# EAGLE design communication (EAGLE 6.1)
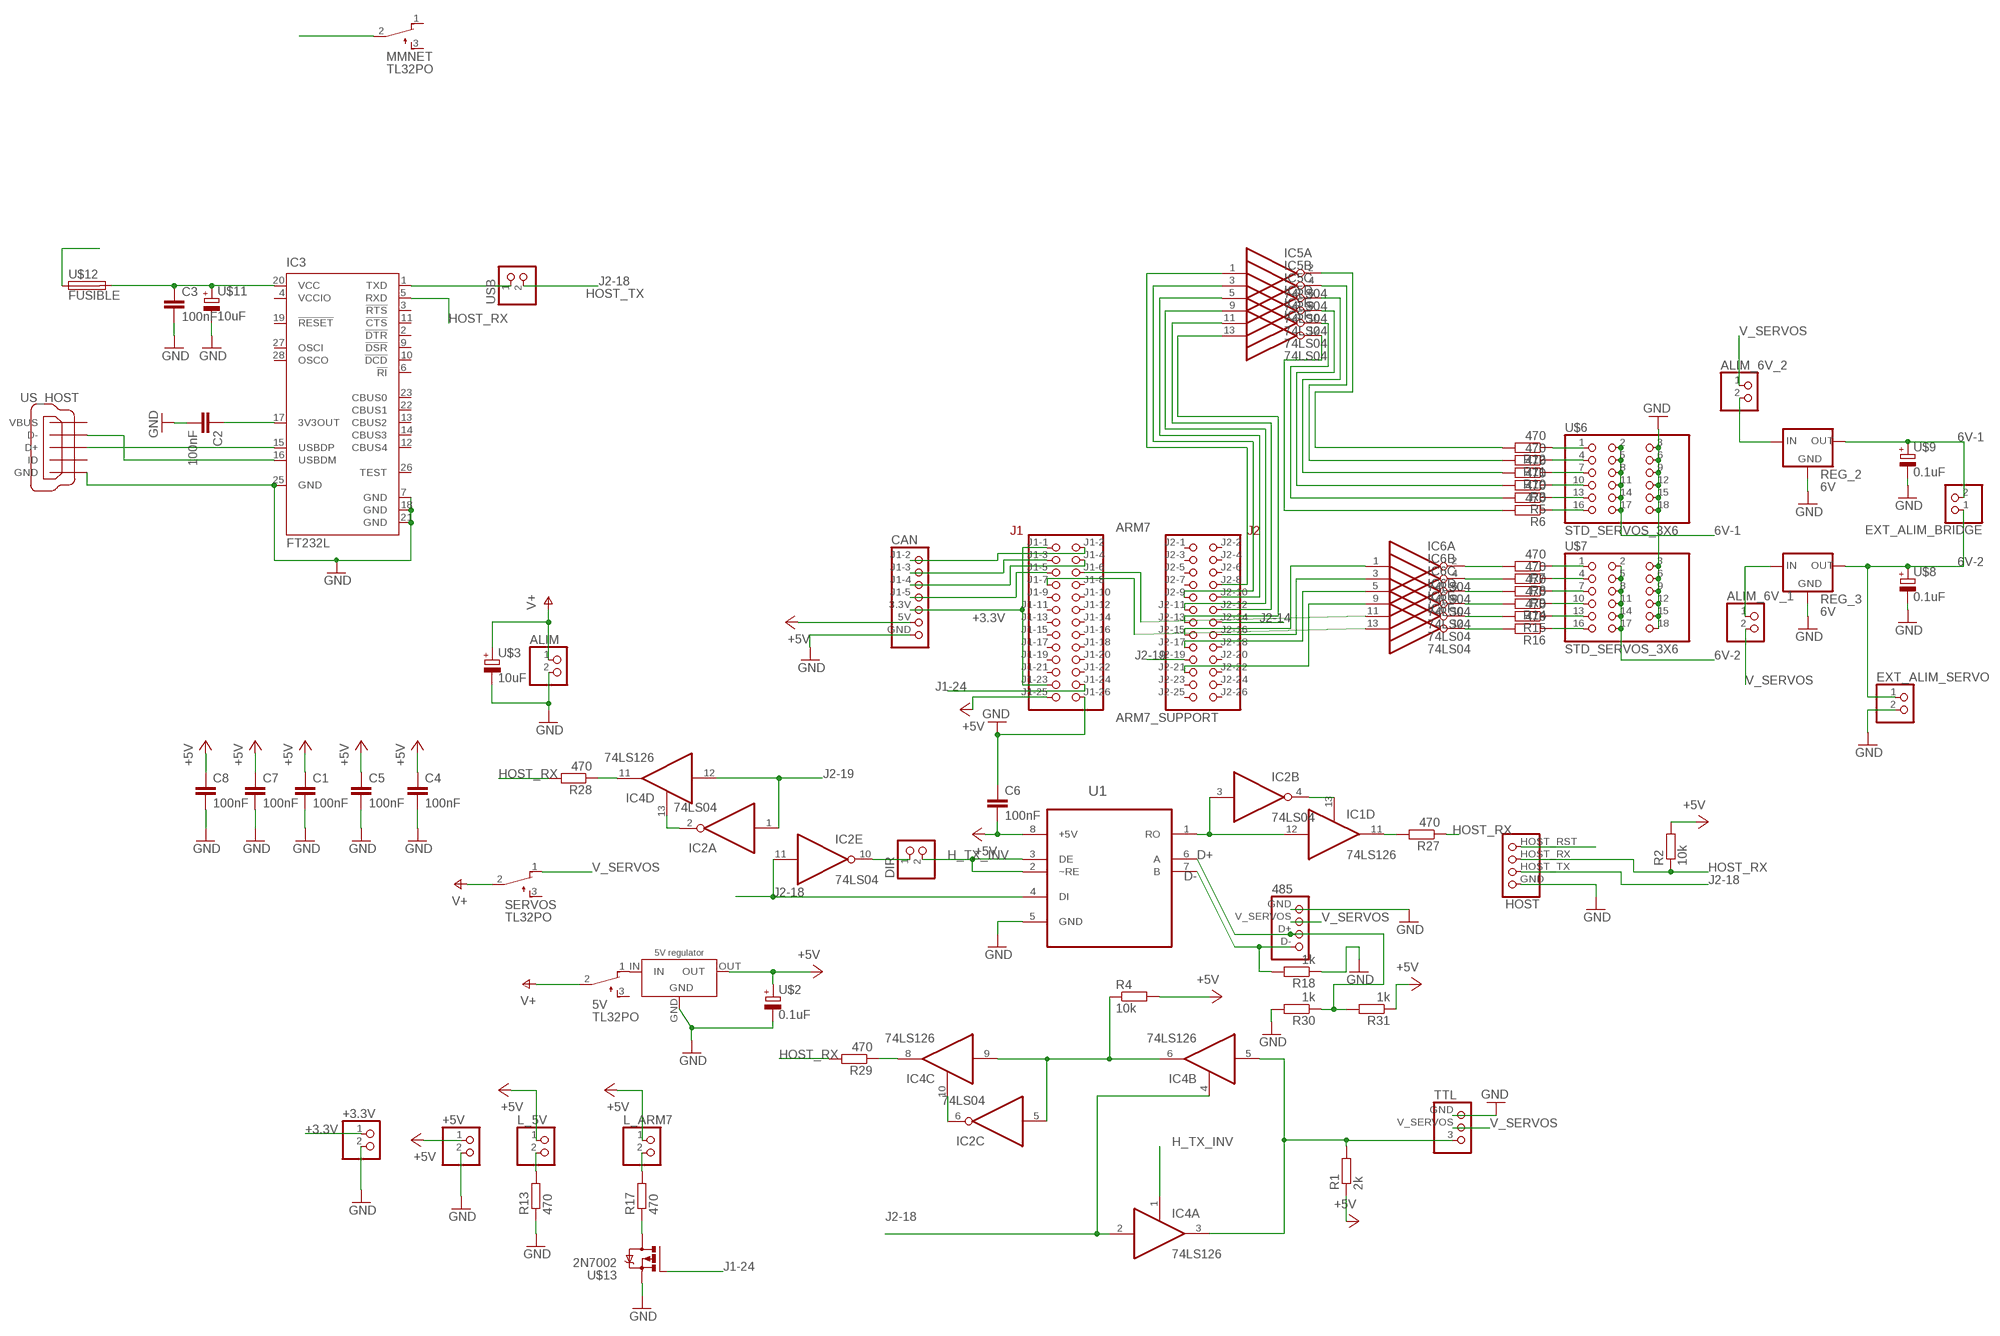
[diagram p0: schematic, sheet 1]

## Parts
5V  TL32PO  [TL3XPO]
485  CONNECTEUR_485  [CONNECTEUR_485]
+3.3V  CONNEC_1X02  [CONNEC_1X02]
+5V  CONNEC_1X02  [CONNEC_1X02]
ALIM  CONNEC_1X02CONNEC_1X02_LARGE  [CONNEC_ALIM]
ALIM_6V_1  CONNEC_1X02  [CONNEC_1X02]
ALIM_6V_2  CONNEC_1X02  [CONNEC_1X02]
ARM7  ARM7_SUPPORT  [ARM7_SUPPORT]
C1  100nF  C_EU_0805  [R0805]
C2  100nF  C_EU_0805  [R0805]
C3  100nF  C_EU_0805  [R0805]
C4  100nF  C_EU_0805  [R0805]
C5  100nF  C_EU_0805  [R0805]
C6  100nF  C_EU_0805  [R0805]
C7  100nF  C_EU_0805  [R0805]
C8  100nF  C_EU_0805  [R0805]
CAN  CONNECTEUR_CAN  [CONNECTEUR_CAN]
DIR  CONNEC_1X02  [CONNEC_1X02]
EXT_ALIM_BRIDGE  CONNEC_1X02  [CONNEC_1X02]
EXT_ALIM_SERVO  CONNEC_1X02CONNEC_1X02_LARGE  [CONNEC_ALIM]
HOST  CONNECTOR_HOST  [CONNECTOR_HOST]
IC1  74LS126  74LS126D  [SO14]
IC2  74LS04  74LS04D  [SO14]
IC3  FT232L  [SSOP28]
IC4  74LS126  74LS126D  [SO14]
IC5  74LS04  74LS04D  [SO14]
IC6  74LS04  74LS04D  [SO14]
L_5V  CONNEC_1X02  [CONNEC_1X02]
L_ARM7  CONNEC_1X02  [CONNEC_1X02]
MMNET  TL32PO  [TL3XPO]
R1  2k  R-EU_R0805  [R0805@1]
R2  10k  R-EU_R0805  [R0805@1]
R3  470  R-EU_R0805  [R0805@1]
R4  10k  R-EU_R0805  [R0805@1]
R5  470  R-EU_R0805  [R0805@1]
R6  470  R-EU_R0805  [R0805@1]
R7  470  R-EU_R0805  [R0805@1]
R8  470  R-EU_R0805  [R0805@1]
R9  470  R-EU_R0805  [R0805@1]
R10  470  R-EU_R0805  [R0805@1]
R11  470  R-EU_R0805  [R0805@1]
R12  470  R-EU_R0805  [R0805@1]
R13  470  R-EU_R0805  [R0805@1]
R14  470  R-EU_R0805  [R0805@1]
R15  470  R-EU_R0805  [R0805@1]
R16  470  R-EU_R0805  [R0805@1]
R17  470  R-EU_R0805  [R0805@1]
R18  1k  R-EU_R0805  [R0805@1]
R27  470  R-EU_R0805  [R0805@1]
R28  470  R-EU_R0805  [R0805@1]
R29  470  R-EU_R0805  [R0805@1]
R30  1k  R-EU_R0805  [R0805@1]
R31  1k  R-EU_R0805  [R0805@1]
REG_2  6V  78XXL  [78XXL]
REG_3  6V  78XXL  [78XXL]
SERVOS  TL32PO  [TL3XPO]
TTL  CONNECTEUR_TTL  [CONNECTEUR_TTL]
U1  MAX485EESA+  [SOIC127P600X175-8N]
U$2  0.1uF  CPOL_EUCPOL_EU_2.54-6  [E2,5-6]
U$3  10uF  CPOL_EUCPOL_EU_5-10,5  [E5-10,5]
U$6  STD_SERVOS_3X6  [STD_SERVOS_3X6]
U$7  STD_SERVOS_3X6  [STD_SERVOS_3X6]
U$8  0.1uF  CPOL_EUCPOL_EU_2.54-6  [E2,5-6]
U$9  0.1uF  CPOL_EUCPOL_EU_2.54-6  [E2,5-6]
U$11  10uF  CPOL_EUCPOL_EU_5-10,5  [E5-10,5]
U$12  FUSIBLE  [FUSIBLE]
U$13  2N7002  [SOT-23]
U$14  5V regulator  REGULATEUR_CMS  [REGULATEUR_CMS]
US_HOST  MINIUSB  [MINI_USB]
USB  CONNEC_1X02  [CONNEC_1X02]

## Nets
6V-1: EXT_ALIM_BRIDGE.2 REG_2.OUT U$6.2 U$6.5 U$6.8 U$6.11 U$6.14 U$6.17 U$9.+
6V-2: EXT_ALIM_BRIDGE.1 EXT_ALIM_SERVO.1 REG_3.OUT U$7.2 U$7.5 U$7.8 U$7.11 U$7.14 U$7.17 U$8.+
+3.3V: +3.3V.1 ARM7.J1-1 ARM7.J1-23 CAN.3.3V
+5V: +5V.1 ARM7.J1-25 C1.1 C3.1 C4.1 C5.1 C6.2 C7.1 C8.1 CAN.5V IC3.20(VCC) L_5V.1 L_ARM7.1 R1.1 R2.2 R4.2 R31.1 U1.8(+5V) U$2.+ U$11.+ U$12.P$1 U$12.P$2 U$14.OUT
B$1: ARM7.J2-8 IC5.1(A:I)
B$2: ARM7.J2-9 IC5.3(B:I)
B$3: ARM7.J2-10 IC5.5(C:I)
B$4: ARM7.J2-11 IC5.9(D:I)
B$5: ARM7.J2-12 IC5.11(E:I)
B$6: ARM7.J2-13 IC5.13(F:I)
B$7: ARM7.J2-15 IC6.1(A:I)
B$8: ARM7.J2-16 IC6.3(B:I)
B$9: ARM7.J2-17 IC6.5(C:I)
B$10: ARM7.J2-21 IC6.9(D:I)
B$11: ARM7.J1-6 IC6.11(E:I)
B$12: ARM7.J1-7 IC6.13(F:I)
D+: 485.D+ R30.1 R31.2 U1.6(A)
D-: 485.D- R18.2 U1.7(B)
GND: 485.GND +3.3V.2 +5V.2 ALIM.2 ARM7.J1-26 C1.2 C2.2 C3.2 C4.2 C5.2 C6.1 C7.2 C8.2 CAN.GND EXT_ALIM_SERVO.2 HOST.GND IC3.7(GND) IC3.18(GND) IC3.21(GND) IC3.25(GND) R13.1 R18.1 R30.2 REG_2.GND REG_3.GND TTL.GND U1.5(GND) U$2.- U$3.- U$6.3 U$6.6 U$6.9 U$6.12 U$6.15 U$6.18 U$7.3 U$7.6 U$7.9 U$7.12 U$7.15 U$7.18 U$8.- U$9.- U$11.- U$13.2(S) U$14.GND US_HOST.GND
H_TX_INV: DIR.2 HOST.HOST_RST IC4.1(A:OE) U1.2(~RE) U1.3(DE)
HOST_RX: HOST.HOST_RX IC3.5(RXD) R2.1 R27.1 R28.2 R29.2
J1-2: ARM7.J1-2 CAN.J1-2
J1-3: ARM7.J1-3 CAN.J1-3
J1-4: ARM7.J1-4 CAN.J1-4
J1-5: ARM7.J1-5 CAN.J1-5
J1-24: ARM7.J1-24 U$13.1(G)
J2-14: ARM7.J2-14
J2-18: HOST.HOST_TX IC2.11(E:I) IC4.2(A:I) IC4.4(B:OE) U1.4(DI) USB.2
J2-19: ARM7.J2-19 IC2.1(A:I) IC4.12(D:I)
N$1: IC2.6(C:O) IC4.10(C:OE)
N$2: IC2.5(C:I) IC4.6(B:O) IC4.9(C:I) R4.1
N$3: 5V.1(O) U$14.IN
N$4: IC6.2(A:O) R7.2
N$5: IC4.3(A:O) IC4.5(B:I) R1.2 TTL.3
N$6: L_5V.2 R13.2
N$7: IC1.12(D:I) IC2.3(B:I) U1.1(RO)
N$8: IC6.4(B:O) R8.2
N$9: R17.1 U$13.3(D)
N$10: L_ARM7.2 R17.2
N$11: IC3.1(TXD) USB.1
N$12: IC1.13(D:OE) IC2.4(B:O)
N$13: IC6.6(C:O) R9.2
N$14: IC6.8(D:O) R14.2
N$15: IC2.2(A:O) IC4.13(D:OE)
N$16: R12.1 U$6.1
N$17: R11.1 U$6.4
N$18: R10.1 U$6.7
N$19: R3.1 U$6.10
N$20: R5.1 U$6.13
N$21: R6.1 U$6.16
N$22: R7.1 U$7.1
N$23: R8.1 U$7.4
N$24: R9.1 U$7.7
N$25: R14.1 U$7.10
N$26: R15.1 U$7.13
N$27: R16.1 U$7.16
N$28: IC6.10(E:O) R15.2
N$29: IC6.12(F:O) R16.2
N$43: DIR.1 IC2.10(E:O)
N$44: C2.1 IC3.17(3V3OUT)
N$45: IC3.15(USBDP) US_HOST.D+
N$46: IC3.16(USBDM) US_HOST.D-
N$49: IC5.12(F:O) R6.2
N$50: IC5.10(E:O) R5.2
N$51: IC5.8(D:O) R3.2
N$52: IC5.6(C:O) R10.2
N$53: IC5.4(B:O) R11.2
N$54: IC5.2(A:O) R12.2
TO_RX-1: IC1.11(D:O) R27.2
TO_RX-2: IC4.8(C:O) R29.1
TO_RX-3: IC4.11(D:O) R28.1
V+: 5V.2(P) ALIM.1 MMNET.2(P) SERVOS.2(P) U$3.+
V_SERVOS: 485.V_SERVOS ALIM_6V_1.2 ALIM_6V_2.1 SERVOS.1(O) TTL.V_SERVOS
V_SERVOS_6V1: ALIM_6V_1.1 REG_3.IN
V_SERVOS_6V2: ALIM_6V_2.2 REG_2.IN
Unconnected: 5V.3(S) ARM7.J1-8 ARM7.J1-9 ARM7.J1-10 ARM7.J1-11 ARM7.J1-12 ARM7.J1-13 ARM7.J1-14 ARM7.J1-15 ARM7.J1-16 ARM7.J1-17 ARM7.J1-18 ARM7.J1-19 ARM7.J1-20 ARM7.J1-21 ARM7.J1-22 ARM7.J2-1 ARM7.J2-2 ARM7.J2-3 ARM7.J2-4 ARM7.J2-5 ARM7.J2-6 ARM7.J2-7 ARM7.J2-18 ARM7.J2-20 ARM7.J2-22 ARM7.J2-23 ARM7.J2-24 ARM7.J2-25 ARM7.J2-26 IC1.1(A:OE) IC1.2(A:I) IC1.3(A:O) IC1.4(B:OE) IC1.5(B:I) IC1.6(B:O) IC1.8(C:O) IC1.9(C:I) IC1.10(C:OE) IC2.8(D:O) IC2.9(D:I) IC2.12(F:O) IC2.13(F:I) IC3.2(!DTR) IC3.3(!RTS) IC3.6(!RI) IC3.9(!DSR) IC3.10(!DCD) IC3.11(!CTS) IC3.12(CBUS4) IC3.13(CBUS2) IC3.14(CBUS3) IC3.19(!RESET) IC3.22(CBUS1) IC3.23(CBUS0) IC3.26(TEST) IC3.27(OSCI) IC3.28(OSCO) MMNET.1(O) MMNET.3(S) SERVOS.3(S) US_HOST.ID US_HOST.VBUS

## Notes on the sheet
- HOST_TX

## Power pins joined to a net without a drawn wire
+5V: IC1.14(P:+5V) IC2.14(P:+5V) IC4.14(P:+5V) IC5.14(P:+5V) IC6.14(P:+5V)
GND: IC1.7(P:GND) IC2.7(P:GND) IC4.7(P:GND) IC5.7(P:GND) IC6.7(P:GND) U$14.GND2(GND)
VCCIO: IC3.4(VCCIO)

## Library data of the parts
5V MMNET SERVOS = rhoban:TL32PO
485 = rhoban:CONNECTEUR_485
+3.3V +5V ALIM ALIM_6V_1 ALIM_6V_2 DIR EXT_ALIM_BRIDGE EXT_ALIM_SERVO L_5V L_ARM7 USB = rhoban:CONNEC_1X02
ARM7 = rhoban:ARM7_SUPPORT: The support used for the ARM7
C1-C8 = rhoban:C_EU: non polarised condo
CAN = rhoban:CONNECTEUR_CAN
HOST = rhoban:CONNECTOR_HOST
IC1 IC4 = rhoban:74*126: Quad bus BUFFER, 3-state
IC2 IC5 IC6 = rhoban:74*04: Hex INVERTER
IC3 = rhoban:FT232: Source: http://www.ftdichip.com/Documents/DataSheets/DS_FT232R_v104.pdf; MPN: FT232RL; OC_FARNELL: 1146032; OC_NEWARK: 91K9918
R1-R18 R27-R31 = rhoban:R-EU_: RESISTOR, European symbol
REG_2 REG_3 = rhoban:78XXL: Régulateur de tension
TTL = rhoban:CONNECTEUR_TTL
U1 = rhoban:MAX485EESA+; DESCRIPTION: ±15kV ESD-Protected, Slew-Rate-Limited, Low-Power, RS-485/RS-422 Transceivers; MPN: MAX485EESA+; OC_FARNELL: 1379973; OC_NEWARK: 68K4798; PACKAGE: SOIC-8; SUPPLIER: Maxim
U$2 U$3 U$8 U$9 U$11 = rhoban:CPOL_EU: unused
U$6 U$7 = rhoban:STD_SERVOS_3X6
U$12 = rhoban:FUSIBLE
U$13 = rhoban:2N7002
U$14 = rhoban:REGULATEUR_CMS
US_HOST = rhoban:MINIUSB

## Board
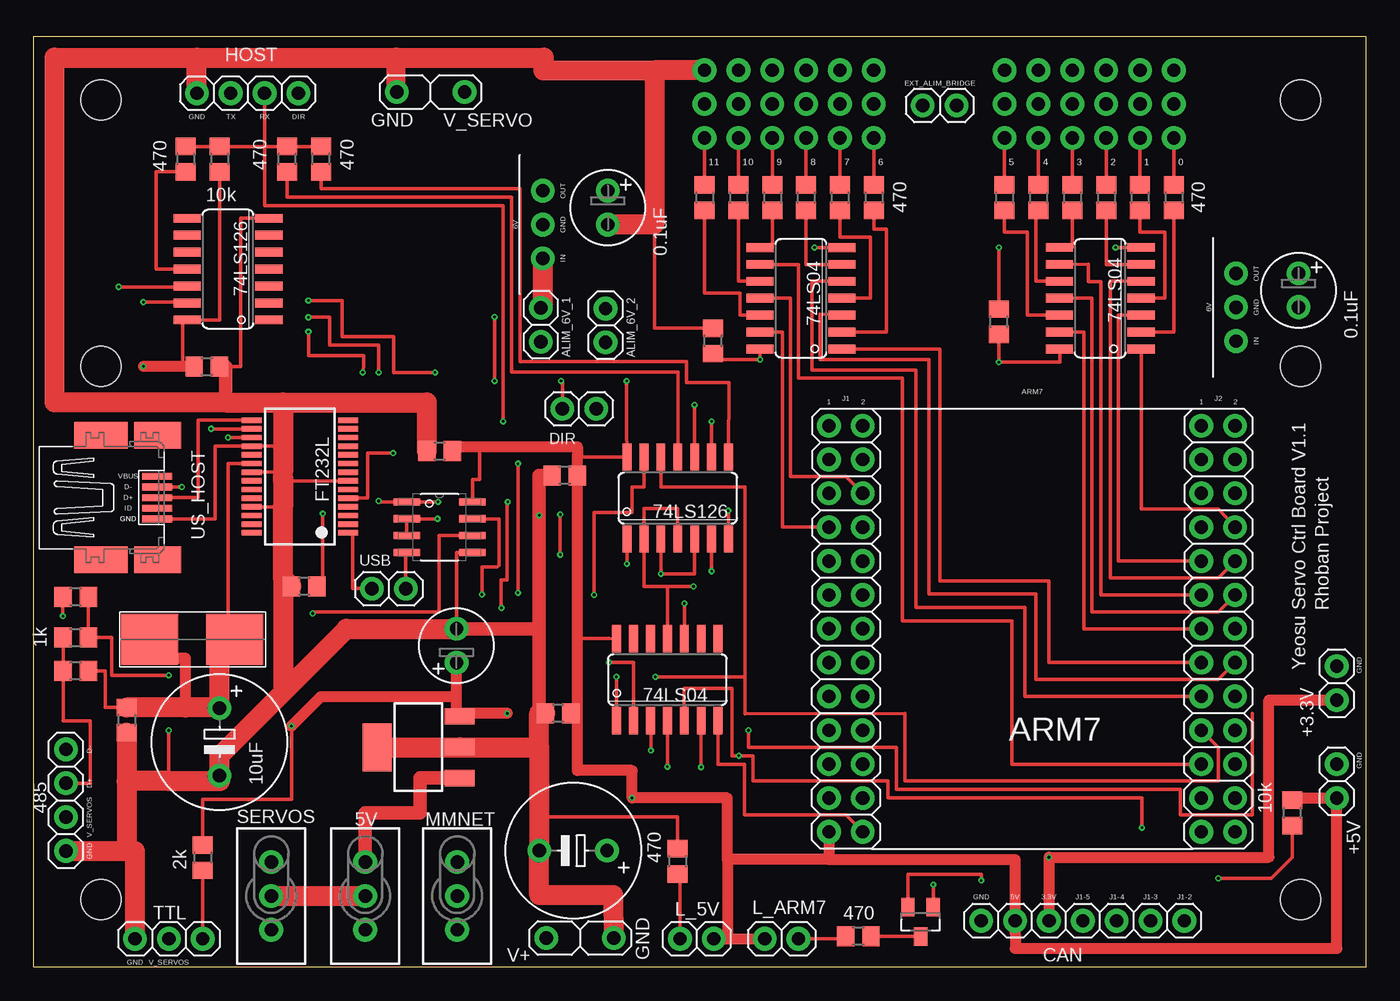
[diagram p1: board, top side]
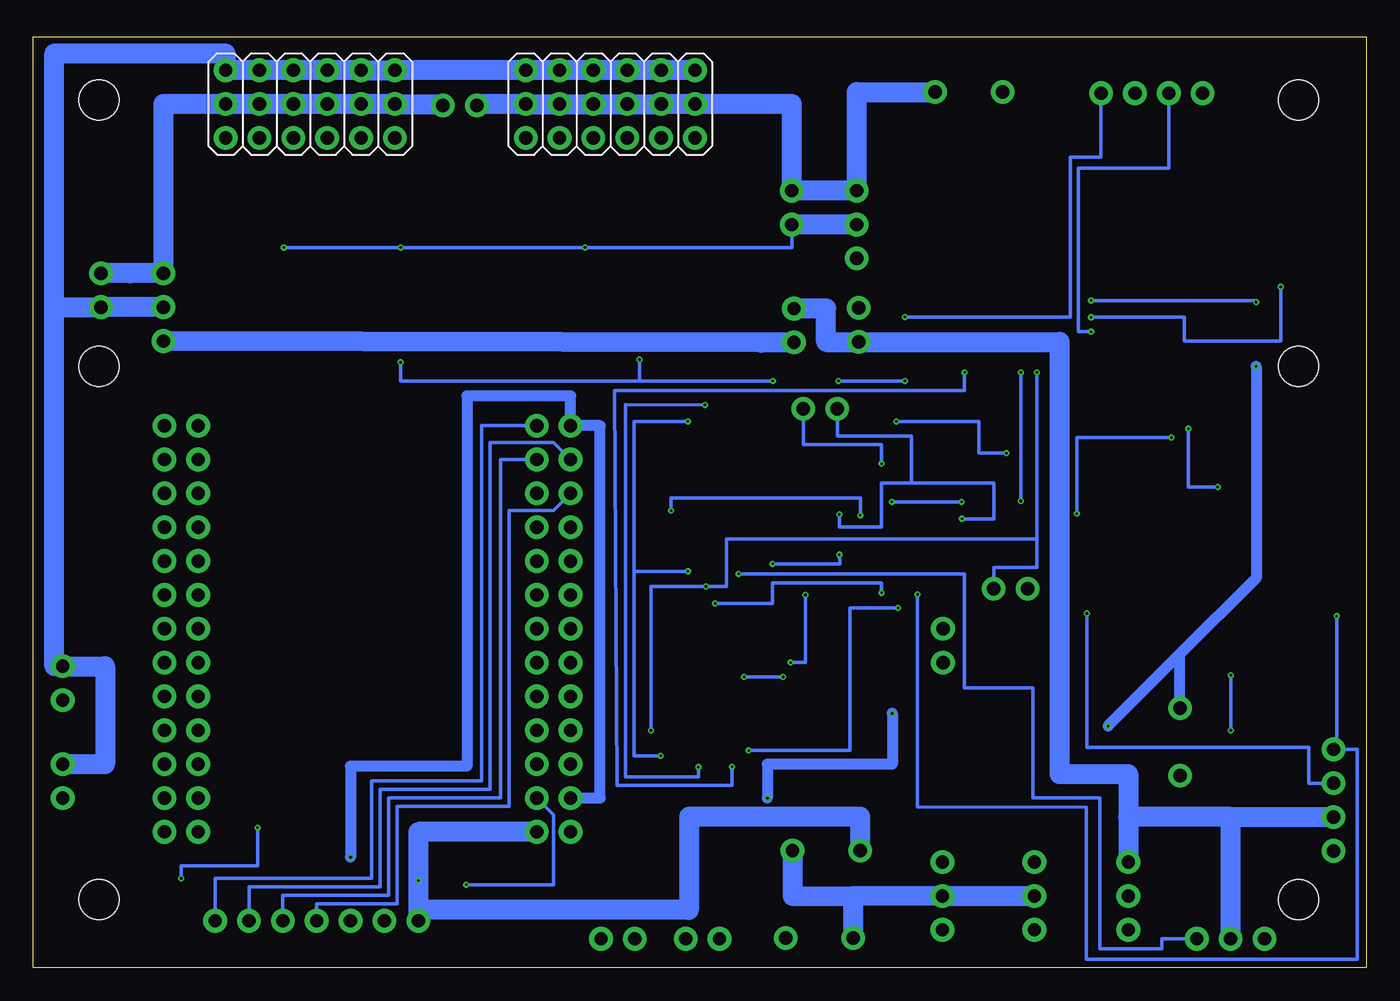
[diagram p2: board, bottom side, seen from below]

Size 100 x 69.85 mm. Coordinates in mm from the lower left corner, seen from the top.
Outline: 100,0.01 100,69.85 0,69.85 0,0.01
Outline: 100,0 0,0
Copper layers (1*16): Top 0.035mm / dielectric 1.5mm / Bottom 0.035mm
Design rules: minimum track width 0.125mm, minimum drill 0.2mm, track to track 0.125mm, track to pad 0.125mm, pad to pad 0.125mm, via to via 0.125mm, smd to smd 0.125mm, copper to edge 0.3mm, drill to drill 0.2mm, minimum pad ring 0.2mm, minimum via ring 0.125mm, stop-mask expansion 0.075mm, vias tented up to drill 0mil, thermal gap 0.2mm
Holes 3 mm at 5.08,5.09 95.07,5.09 5.08,45.09 95.07,45.09 5.08,65.08 95.07,65.08

### Footprints (pad centres in the part's own frame; a part is rotated, then mirrored left to right if it is on the bottom)
TL3XPO = drill 1 pad 1.778: 1 -1.27,0; 2 1.27,0; 3 3.81,0
CONNECTEUR_485 = drill 1 pad 1.778: D+ 3.81,1.27; D- 6.35,1.27; GND -1.27,1.27; V_SERVOS 1.27,1.27
CONNEC_1X02 = drill 1 pad 1.778: 1 -1.27,1.27; 2 1.27,1.27
CONNEC_ALIM = drill 1 pad 1.778: 1 -2.54,0; 2 2.54,0
ARM7_SUPPORT = drill 1 pad 1.778: J1-1 1.27,1.27; J1-2 1.27,3.81; J1-3 3.81,1.27; J1-4 3.81,3.81; J1-5 6.35,1.27; J1-6 6.35,3.81; J1-7 8.89,1.27; J1-8 8.89,3.81; J1-9 11.43,1.27; J1-10 11.43,3.81; J1-11 13.97,1.27; J1-12 13.97,3.81; J1-13 16.51,1.27; J1-14 16.51,3.81; J1-15 19.05,1.27; J1-16 19.05,3.81; J1-17 21.59,1.27; J1-18 21.59,3.81; J1-19 24.13,1.27; J1-20 24.13,3.81; J1-21 26.67,1.27; J1-22 26.67,3.81; J1-23 29.21,1.27; J1-24 29.21,3.81; J1-25 31.75,1.27; J1-26 31.75,3.81; J2-1 1.27,29.21; J2-2 1.27,31.75; J2-3 3.81,29.21; J2-4 3.81,31.75; J2-5 6.35,29.21; J2-6 6.35,31.75; J2-7 8.89,29.21; J2-8 8.89,31.75; J2-9 11.43,29.21; J2-10 11.43,31.75; J2-11 13.97,29.21; J2-12 13.97,31.75; J2-13 16.51,29.21; J2-14 16.51,31.75; J2-15 19.05,29.21; J2-16 19.05,31.75; J2-17 21.59,29.21; J2-18 21.59,31.75; J2-19 24.13,29.21; J2-20 24.13,31.75; J2-21 26.67,29.21; J2-22 26.67,31.75; J2-23 29.21,29.21; J2-24 29.21,31.75; J2-25 31.75,29.21; J2-26 31.75,31.75
R0805 = smd 1.3 x 1.5: 1 -0.95,0; 2 0.95,0
CONNECTEUR_CAN = drill 1 pad 1.778: 3.3V 8.89,1.27; 5V 11.43,1.27; GND 13.97,1.27; J1-2 -1.27,1.27; J1-3 1.27,1.27; J1-4 3.81,1.27; J1-5 6.35,1.27
CONNECTOR_HOST = drill 1 pad 1.778: GND -1.27,1.27; HOST_RST 6.35,1.27; HOST_RX 3.81,1.27; HOST_TX 1.27,1.27
SO14 = smd 0.66 x 2.032: 1 -3.81,-3.073; 2 -2.54,-3.073; 3 -1.27,-3.073; 4 0,-3.073; 5 1.27,-3.073; 6 2.54,-3.073; 7 3.81,-3.073; 8 3.81,3.073; 9 2.54,3.073; 10 1.27,3.073; 11 0,3.073; 12 -1.27,3.073; 13 -2.54,3.073; 14 -3.81,3.073
SSOP28 = smd 0.4 x 1.5: 1 -4.225,-3.625; 2 -3.575,-3.625; 3 -2.925,-3.625; 4 -2.275,-3.625; 5 -1.625,-3.625; 6 -0.975,-3.625; 7 -0.325,-3.625; 8 0.325,-3.625; 9 0.975,-3.625; 10 1.625,-3.625; 11 2.275,-3.625; 12 2.925,-3.625; 13 3.575,-3.625; 14 4.225,-3.625; 15 4.225,3.625; 16 3.575,3.625; 17 2.925,3.625; 18 2.275,3.625; 19 1.625,3.625; 20 0.975,3.625; 21 0.325,3.625; 22 -0.325,3.625; 23 -0.975,3.625; 24 -1.625,3.625; 25 -2.275,3.625; 26 -2.925,3.625; 27 -3.575,3.625; 28 -4.225,3.625
R0805@1 = smd 1.3 x 1.5: 1 -0.95,0; 2 0.95,0
78XXL = drill 1 pad 1.778: GND 5.08,-2.54; IN 2.54,-2.54; OUT 7.62,-2.54
CONNECTEUR_TTL = drill 1 pad 1.778: 3 3.81,1.27; GND -1.27,1.27; V_SERVOS 1.27,1.27
SOIC127P600X175-8N = smd 1.981 x 0.533: 1 -2.464,1.905; 2 -2.464,0.635; 3 -2.464,-0.635; 4 -2.464,-1.905; 5 2.464,-1.905; 6 2.464,-0.635; 7 2.464,0.635; 8 2.464,1.905
E2,5-6 = drill 1 pad 1.778: + -1.27,0; - 1.27,0
E5-10,5 = drill 1 pad 1.778: + -2.54,0; - 2.54,0
STD_SERVOS_3X6 = drill 1 pad 1.778: 1 -6.35,-1.27; 2 -6.35,1.27; 3 -6.35,3.81; 4 -3.81,-1.27; 5 -3.81,1.27; 6 -3.81,3.81; 7 -1.27,-1.27; 8 -1.27,1.27; 9 -1.27,3.81; 10 1.27,-1.27; 11 1.27,1.27; 12 1.27,3.81; 13 3.81,-1.27; 14 3.81,1.27; 15 3.81,3.81; 16 6.35,-1.27; 17 6.35,1.27; 18 6.35,3.81
FUSIBLE = smd 4.242 x 3.81: P$1 0,0; P$2 6.375,0
SOT-23 = smd 1 x 1.4: 1 -0.95,-1.1; 2 0.95,-1.1; 3 0,1.1
REGULATEUR_CMS = smd 1.219 x 2.235: GND 0,-3.099; IN -2.311,-3.099; OUT 2.311,-3.099 | smd 3.6 x 2.2: GND2 0,3.099
MINI_USB = smd 2.25 x 0.5: D+ 4.225,0; D- 4.225,0.8; GND 4.225,-1.6; ID 4.225,-0.8; VBUS 4.225,1.6 | smd 4 x 2: M1 0,-4.671; M5 0,4.671 | smd 3.5 x 2: M3 4.25,4.671; M4 4.25,-4.671

### Placement (x,y rotation side)
5V  24.9,6.63 270 top
485  3.71,10.01 90 top
+3.3V  99.06,21.33 90 top
+5V  99.06,13.98 90 top
ALIM  41.02,2.2 0 top
ALIM_6V_1  36.8,48.21 270 top
ALIM_6V_2  41.66,48.17 270 top
ARM7  58.42,41.92 270 top
C1  13.02,45.09 0 top
C2  20.32,28.59 180 top
C3  7,18.56 270 top
C4  39.37,19.06 180 top
C5  39.87,36.92 180 top
C6  30.48,38.74 0 top
C7  72.44,48.45 90 top
C8  51,47.01 90 top
CAN  85.09,4.77 180 top
DIR  40.96,43.19 180 top
EXT_ALIM_BRIDGE  68,63.41 0 top
EXT_ALIM_SERVO  29.81,65.68 180 top
HOST  13.54,64.33 0 top
IC1  14.61,52.4 90 top
IC2  47.57,21.59 0 top
IC3  20,36.84 90 top
IC4  48.35,35.21 0 top
IC5  80.04,50.21 90 top
IC6  57.6,50.21 90 top
L_5V  49.79,3.42 180 top
L_ARM7  56.14,0.88 0 top
MMNET  31.8,6.63 270 top
R1  12.71,8.23 270 top
R2  13.97,60.65 270 top
R3  77.95,57.76 270 top
R4  94.46,11.6 90 top
R5  75.41,57.76 270 top
R6  72.87,57.76 270 top
R7  63.06,57.76 270 top
R8  60.52,57.76 270 top
R9  57.98,57.76 270 top
R10  80.49,57.76 270 top
R11  83.03,57.76 270 top
R12  85.57,57.76 270 top
R13  48.32,7.96 270 top
R14  55.44,57.76 270 top
R15  52.9,57.76 270 top
R16  50.36,57.76 270 top
R17  61.89,2.35 180 top
R18  3.17,27.79 180 top
R27  11.43,60.65 270 top
R28  19.05,60.65 90 top
R29  21.59,60.65 90 top
R30  3.17,24.78 0 top
R31  3.17,22.24 180 top
REG_2  87.7,44.46 90 top
REG_3  35.68,50.66 90 top
SERVOS  17.85,6.63 270 top
TTL  8.9,0.88 0 top
U1  30.48,33.03 0 top
U$2  31.75,24.14 90 top
U$3  40.5,8.76 180 top
U$6  79.22,63.51 0 bottom
U$7  56.71,63.51 0 bottom
U$8  43.1,57.01 270 top
U$9  94.92,50.81 270 top
U$11  13.97,16.92 270 top
U$12  8.73,24.62 0 top
U$13  66.57,3.42 180 top
U$14  28.89,16.52 90 top
US_HOST  5.08,35.25 0 top
USB  26.67,27.15 0 top

### Tracks (layer width: path | path; a pad name or v marks a point on that pad's centre or on a via)
6V-1
  Bottom 0.254: 90.24,64.75 90.23,64.75 90.23,64.78
  Bottom 1.5: REG_2.OUT 92.71,52.08 | REG_2.OUT U$9.+ | EXT_ALIM_BRIDGE.2 69.27,64.78 U$6.17 U$6.14 U$6.11 U$6.8 U$6.5 U$6.2 90.23,64.78 | 90.24,64.75 REG_2.OUT
6V-2
  Bottom 1.5: EXT_ALIM_BRIDGE.1 66.73,64.78 U$7.2 U$7.5 U$7.8 U$7.11 U$7.14 U$7.17 43.1,64.78 U$8.+ REG_3.OUT 38.22,65.68 EXT_ALIM_SERVO.1
+3.3V  (via drill 0.2 pad 0.41)
  Top 0.813: +3.3V.1 92.71,20.06 92.71,8.27 v76.2,8.27 CAN.3.3V
  Bottom 0.813: ARM7.J1-23 57.47,12.71 57.47,40.65 ARM7.J1-1 59.69,42.87 67.47,42.87 67.47,15.09 76.2,15.09 v76.2,8.27
+5V  (via drill 0.2 pad 0.41)
  Top 0.254: R4.2 94.46,12.71 | IC2.14 43.18,24.67 40.82,24.67 | U1.8 32.94,36.6 33.5,36.6 33.5,39.06 32.94,39.06 | 40.82,38.43 40.87,38.29 IC4.14 44.53,38.78 44.52,40.21 v44.52,44.01 | R2.2 13.97,48.59 IC1.14 11.21,48.59 11.21,45.21 11.1,45.09 | 32.38,18.93 32.38,19.06 | R31.1 5.4,22.24 5.4,19.51 C3.1 | U$12.P$2 14.61,24.14 14.61,37.81 IC3.20 | R1.1 12.71,12.61 19.37,12.61 v19.37,18.11 | C8.1 51,45.61 v54.53,45.61 IC6.14 | IC5.14 77,46.37 77,45.41 v72.44,45.41 C7.1 72.4,46.93 | U$12.P$1 10,24.62 10,23.21
  Top 0.813: 94.46,12.71 +5V.1 97.81,1.43 73.68,1.43 CAN.5V 73.66,8.11 59.69,8.11 | C6.2 31.43,39.06 32.94,39.06 40.82,39.06 40.82,38.43 C5.1 40.82,24.67 40.82,19.06 | C1.1 11.1,45.09 v8.26,45.09 | v19.37,18.11 21.59,20.33 31.75,20.33 | ARM7.J1-25 59.69,8.11 | 59.69,8.11 52.07,8.11 | 52.07,8.11 52.07,2.15 | 52.07,8.11 52.07,12.71 v44.93,12.71 44.93,14.77 40.82,14.77 40.82,19.06 | v35.56,19.06 32.38,19.06 31.99,19.06 | 31.75,20.33 31.75,19.06 31.99,19.06 | 31.75,20.33 U$2.+ | L_5V.1 52.07,2.15 | 52.07,2.15 L_ARM7.1 | 31.99,19.06 U$14.OUT | 10,23.21 11.4,23.21 11.4,19.51 | C4.1 40.82,19.06
  Top 1.5: C3.1 11.4,19.51 13.97,19.51 U$11.+ 13.97,24.62 U$12.P$2
  Bottom 0.254: v44.52,44.01 54.53,44.01 | 54.53,44.01 72.44,44.01 v72.44,45.41 | v54.53,45.61 54.53,44.01
  Bottom 0.813: v35.56,19.06 35.56,15.25 44.93,15.25 v44.93,12.71 | v8.26,45.09 8.26,29.22 13.97,23.51 | 13.97,23.51 v19.37,18.11 | U$11.+ 13.97,23.51
B$1
  Top 0.254: IC5.1 83.11,34.41 88.9,34.41 ARM7.J2-8
B$2
  Top 0.254: IC5.3 81.4,48.94 81.4,30.49 ARM7.J2-9
B$3
  Top 0.254: IC5.5 80.8,51.48 80.8,29.22 88.9,29.22 ARM7.J2-10
B$4
  Top 0.254: IC5.9 79.14,52.76 79.14,51.45 80.1,51.45 80.1,27.95 ARM7.J2-11
B$5
  Top 0.254: IC5.11 79.4,50.21 79.4,26.68 88.9,26.68 ARM7.J2-12
B$6
  Top 0.254: IC5.13 78.8,47.67 78.8,25.41 ARM7.J2-13
B$7
  Top 0.254: IC6.1 68,46.41 68,29.01 76.2,29.01 76.2,22.87 ARM7.J2-15
B$8
  Top 0.254: IC6.3 59,49.01 59,45.61 67.2,45.61 67.2,28.01 75.2,28.01 75.2,21.6 88.9,21.6 ARM7.J2-16
B$9
  Top 0.254: IC6.5 58.4,51.48 58.4,44.81 66.2,44.81 66.2,27.01 74.4,27.01 74.4,20.33 ARM7.J2-17
B$10
  Top 0.254: IC6.9 57.4,52.75 57.4,44.21 65.2,44.21 65.2,26.01 73.4,26.01 73.4,15.25 ARM7.J2-21
B$11
  Top 0.254: IC6.11 56.8,50.21 56.8,36.84 60.96,36.84 ARM7.J1-6
B$12
  Top 0.254: IC6.13 56.2,47.67 56.2,33.03 ARM7.J1-7
D+  (via drill 0.2 pad 0.41)
  Top 0.254: U1.6 30.45,32.39 30.45,26.68 20.95,26.68 v20.95,26.55 | R30.1 R31.2 2.23,18.51 4.29,18.51 4.29,13.82 485.D+
  Bottom 0.254: v20.95,26.55 20.95,16.52 4.3,16.52 4.3,13.82 485.D+
D-  (via drill 0.2 pad 0.41)
  Top 0.254: U1.7 34.92,33.66 34.92,30.17 34.8,30.05 33.66,30.05 v33.66,27.98 | R18.2 2.22,27.95 v2.22,26.36
  Bottom 0.254: v33.66,27.98 33.66,12.03 21,12.01 21,0.63 0.67,0.63 0.67,16.36 485.D- 2.22,16.38 v2.22,26.36
GND  (via drill 0.2 pad 0.41)
  Top 0.2: 65.62,5.72 65.6,5.72 65.6,5.61
  Top 0.254: ARM7.J1-26 60.96,11.44 53.34,11.44 53.34,15.25 51.38,15.24 IC2.7 | 18.73,34.56 18.41,34.62 | 18.41,34.62 18.73,34.62 19.05,34.62 | 14.45,45.09 15.56,45.09 15.56,56.21 IC1.7 | U1.5 31.75,31.12 U$2.- | IC4.7 v52.14,34.27 | US_HOST.GND 13.65,33.65 13.65,39.11 IC3.18 18.73,39.11 18.73,39.06 | IC3.7 18.73,36.52 | 18.73,37.16 IC3.21 | IC3.25 18.41,34.56 18.41,34.62 | U$13.2 65.62,5.72 65.62,7 71.12,7 v71.12,6.52 | R18.1 R30.2 5.87,24.78 5.87,21.92 v10.16,21.92 | v10.16,17.79 10.16,13.98 | 46.6,55.74 46.6,47.96 C8.2 | IC6.7 v58.6,54.02 | IC5.7 v81.2,54.02 | v72.44,54.02 C7.2 | R13.1 48.32,11.3 37.96,11.3
  Top 0.305: 18.73,37.16 18.73,36.83
  Top 1.016: U$2.- 37.96,25.41 | C5.2 37.96,36.92 v37.96,33.92 37.96,25.41 | 14.45,42.4 14.45,45.09 C1.2 | 37.96,25.41 37.96,18.81
  Top 1.422: EXT_ALIM_SERVO.2 27.23,65.66 27.23,68.27
  Top 1.5: 18.73,36.83 18.73,36.52 18.73,34.62 18.73,34.56 18.73,29.22 | 18.73,42.4 14.45,42.4 1.59,42.4 1.59,68.27 12.27,68.27 | 18.73,42.4 18.73,39.06 18.73,37.16 | 18.73,20.65 13.97,15.88 U$11.- 14,14.38 14,13.98 10.16,13.98 7,13.98 | 18.73,20.65 23.5,25.41 U$2.- | 18.73,29.22 18.73,20.65 | C2.2 18.73,29.22 | 18.73,42.4 29.53,42.4 C6.1 | 485.GND 7,8.74 | 7,8.74 7.63,8.74 TTL.GND | 37.96,16.52 37.96,11.3 U$3.- 37.96,5.41 43.53,5.41 ALIM.2 | HOST.GND 12.27,68.27 | 12.27,68.27 27.23,68.27 38.28,68.27 38.26,67.32 46.6,67.32 | U$14.GND2 U$14.GND 37.96,16.52 | 46.6,67.32 46.6,55.74 U$8.- | U$7.18 46.6,67.32 | 37.96,16.52 37.96,18.81 37.96,19.06 C4.2 | C3.2 7,13.98 | 7,13.98 7,8.74
  Bottom 0.254: v37.96,33.92 37.96,35.24 52.14,35.24 v52.14,34.27 | v10.16,21.92 v10.16,17.79 | U$8.- 43.1,54.02 v58.6,54.02 v72.44,54.02 v81.2,54.02
  Bottom 1.5: REG_2.GND U$9.- 98.42,49.54 | REG_3.GND U$8.- | 98.42,49.54 98.42,22.6 +3.3V.2 94.61,22.6 94.61,15.25 +5V.2 | 98.42,49.54 98.42,68.59 85.57,68.59 U$6.3 U$6.6 U$6.9 U$6.12 U$6.15 U$6.18 U$7.3 U$7.6 U$7.9 U$7.12 U$7.15 U$7.18 | U$3.- 37.96,11.3 50.8,11.3 50.81,4.31 71.12,4.31 | ARM7.J1-26 71.12,10.17 v71.12,6.52 71.12,4.31 | 71.12,4.31 CAN.GND
H_TX_INV  (via drill 0.2 pad 0.41)
  Top 0.254: U1.2 U1.3 28.02,33.58 28.1,33.66 v30.32,33.66 | v39.53,33.98 v39.53,30.97 | v44.53,30.28 IC4.1 | v34.6,48.81 v34.6,44.01 | v39.6,44.01 39.69,44.01 DIR.2
  Bottom 0.254: v30.32,33.66 27.94,33.66 27.94,36.36 34.13,36.36 | DIR.2 39.69,39.86 34.13,39.86 34.13,36.36 | 34.13,36.36 36.35,36.36 36.35,33.03 39.53,33.03 v39.53,33.98 | v39.53,30.97 39.5,30.28 v44.53,30.28 | HOST.HOST_RST 19.89,60.78 22.2,60.78 22.2,48.81 v34.6,48.81 | v34.6,44.01 v39.6,44.01
HOST_RX  (via drill 0.2 pad 0.41)
  Top 0.254: 17.35,61.6 | 17.35,61.6 HOST.HOST_RX | R27.1 R2.1 17.35,61.6 | 17.35,61.6 R28.2 R29.2 17.35,61.6 | 17.35,61.6 17.35,57.16 35.24,57.16 v35.24,40.97 | v26.99,38.59 25.08,38.59 25.08,35.21 IC3.5
  Bottom 0.254: v26.99,38.59 29.05,38.59 29.05,40.97 v35.24,40.97
J1-2
  Bottom 0.254: CAN.J1-2 86.36,6.68 74.61,6.68 74.61,13.98 66.36,13.98 66.36,40.65 ARM7.J1-2
J1-3
  Bottom 0.254: CAN.J1-3 83.82,6.04 73.98,6.04 73.98,13.35 65.72,13.35 65.72,39.22 65.72,39.38 60.96,39.38 ARM7.J1-3
J1-4
  Bottom 0.254: CAN.J1-4 81.28,5.41 73.34,5.41 73.34,12.71 64.93,12.71 64.93,38.11 ARM7.J1-4
J1-5
  Bottom 0.254: CAN.J1-5 78.74,4.77 72.71,4.77 72.71,12.07 64.29,12.07 64.29,34.3 60.96,34.3 ARM7.J1-5
J1-24  (via drill 0.2 pad 0.41)
  Top 0.254: v67.52,6.21 U$13.1
  Bottom 0.254: ARM7.J1-24 60.96,11.44 60.96,6.21 v67.52,6.21
J2-18  (via drill 0.2 pad 0.41)
  Top 0.254: 91.44,19.06 91.44,11.44 86.04,11.44 86.04,13.35 64.77,13.35 64.77,16.52 53.66,16.52 v53.66,17.79 | USB.2 27.94,31.12 U1.4 | IC4.4 48.34,34.42 45.8,34.42 IC4.2 45.81,28.59 47.57,28.59 | 47.57,28.59 IC2.11 | v24.7,44.65 24.77,45.09 24.77,45.92 20.64,45.92 v20.64,47.7 | v49.53,28.59 47.57,28.59
  Bottom 0.254: v53.66,17.79 53.66,28.59 v49.53,28.59 48.01,28.59 48.01,32.14 24.7,32.14 | HOST.HOST_TX 14.81,59.95 21.59,59.95 21.59,47.7 v20.64,47.7 | 24.7,32.14 24.7,30.01 27.94,30.01 USB.2 | 24.7,32.14 v24.7,44.65
J2-19  (via drill 0.2 pad 0.41)
  Top 0.254: ARM7.J2-19 88.9,16.52 88.9,13.98 65.41,13.98 65.41,19.06 53.39,19.03 53.39,21.8 | IC4.12 47.08,36.05 53.39,36.05 53.39,21.8 | IC2.1 v43.74,21.8 | v46.67,21.8 53.39,21.8
  Bottom 0.254: v43.74,21.8 v46.67,21.8
N$1  (via drill 0.2 pad 0.41)
  Top 0.254: v50.11,15.03 IC2.6 | IC4.10 v49.61,42.21
  Bottom 0.254: v50.11,15.03 50.11,14.3 55.56,14.3 55.56,42.24 v49.61,42.21
N$2  (via drill 0.2 pad 0.41)
  Top 0.254: R4.1 94.46,8.27 92.87,6.68 v88.9,6.68 | v83.19,10.49 83.19,12.71 64.14,12.71 64.14,13.98 53.98,13.98 53.98,15.88 v52.93,15.88 52.43,15.87 52.43,20.95 48.82,20.95 IC2.5 | IC4.6 v50.89,29.73 | v50.89,40.97 IC4.9
  Bottom 0.254: v83.19,10.49 83.19,7.63 88.9,7.63 v88.9,6.68 | v50.89,29.73 54.93,29.7 | 54.93,29.7 54.93,15.88 v52.93,15.88 | v50.89,40.97 54.93,40.97 54.93,29.7
N$3
  Top 1.016: U$14.IN 29.01,14.21 29.01,11.61 24.9,11.61 5V.1
N$4
  Top 0.254: R7.2 63.06,55.41 64,55.41 64,47.67 IC6.2
N$5  (via drill 0.2 pad 0.41)
  Top 0.254: IC4.3 v47.08,29.54 49.62,29.54 IC4.5 | TTL.3 R1.2
  Bottom 0.254: v47.08,29.54 30.16,29.54 30.16,20.96 25,20.96 25,12.71 20,12.71 20,1.41 15.35,1.41 15.35,2.15 TTL.3
N$6
  Top 0.254: L_5V.2 48.51,7.01 R13.2
N$7  (via drill 0.2 pad 0.41)
  Top 0.254: v30.35,34.93 U1.1 25.91,34.93 v25.91,35 | v35.12,26.97 35.08,26.97 35.08,29.06 35.56,29.06 35.56,34.93 v35.59,34.93 | v46.33,16.28 46.33,18.31 46.34,18.41 IC2.3 | v6.41,51.06 11.3,51.06 IC1.12 | v25.91,44.65 25.91,46.68 22.23,46.68 22.23,48.78 v20.64,48.78
  Bottom 0.254: v35.12,26.97 38.73,26.97 38.73,16.28 v46.33,16.28 | v6.41,51.06 6.41,47 13.65,47 13.65,48.78 v20.64,48.78 | v25.91,35 v25.91,44.65 | v30.35,34.93 v35.59,34.93
N$8
  Top 0.254: R8.2 60.52,54.81 62.8,54.81 62.8,50.21 IC6.4
N$9
  Top 0.254: R17.1 66.59,2.35 | 66.59,2.35 66.59,2.34 | 66.6,2.29 66.6,2.34 66.59,2.34 | 66.59,2.34 66.59,2.32 | 66.59,2.35 66.59,2.37 66.57,2.37 U$13.3
N$10
  Top 0.254: 60.73,2.26 R17.2 | R17.2 60.88,2.15 | L_ARM7.2 60.94,2.15 R17.2
N$11
  Top 0.254: USB.1 23.95,28.43 23.95,32.61 IC3.1
N$12  (via drill 0.2 pad 0.41)
  Top 0.254: v8.26,49.92 11.18,49.92 IC1.13 | v30.13,44.65 27.02,44.65 27.02,47.32 23.18,47.32 23.18,50.05 v20.64,50.05 | IC2.4 v47.57,15.06
  Bottom 0.254: v8.26,49.92 8.26,50.05 v20.64,50.05 | v30.13,44.65 30.13,43.27 56.4,43.27 56.2,13.66 47.57,13.66 v47.57,15.06
N$13
  Top 0.254: R9.2 57.98,52.75 IC6.6
N$14
  Top 0.254: R14.2 55.44,54.02 IC6.8
N$15  (via drill 0.2 pad 0.41)
  Top 0.254: IC2.2 45.02,22.87 v43.18,22.87 | v42.07,27.95 42.07,34.14 44.94,34.14 44.94,36.05 45.81,36.05 IC4.13
  Top 0.406: IC4.13
  Bottom 0.254: v43.18,22.87 42.07,22.87 v42.07,27.95
N$16
  Top 0.254: R12.1 U$6.1
N$17
  Top 0.254: R11.1 U$6.4
N$18
  Top 0.254: R10.1 U$6.7
N$19
  Top 0.254: R3.1 U$6.10
N$20
  Top 0.254: R5.1 U$6.13
N$21
  Top 0.254: R6.1 U$6.16
N$22
  Top 0.254: R7.1 U$7.1
N$23
  Top 0.254: R8.1 U$7.4
N$24
  Top 0.254: R9.1 U$7.7
N$25
  Top 0.254: R14.1 U$7.10
N$26
  Top 0.254: R15.1 U$7.13
N$27
  Top 0.254: R16.1 U$7.16
N$28
  Top 0.254: R15.2 52.9,51.48 IC6.10
N$29
  Top 0.254: R16.2 50.36,50.61 53,50.61 53,48.94 IC6.12
N$43  (via drill 0.2 pad 0.41)
  Top 0.254: IC2.10 v48.84,27.32 | v36.35,28.11 v36.35,37.79
  Bottom 0.254: v48.84,27.32 44.54,27.32 44.54,28.84 36.35,28.84 v36.35,28.11 | v36.35,37.79 36.35,39.22 42.23,39.22 DIR.1
N$44  (via drill 0.2 pad 0.41)
  Top 0.254: v21.72,34.05 21.72,29.22 C2.1 | IC3.17 v14.61,39.76
  Bottom 0.254: v21.72,34.05 21.72,39.76 v14.61,39.76
N$45
  Top 0.254: US_HOST.D+ 12.38,35.25 12.38,41.06 IC3.15
N$46  (via drill 0.2 pad 0.41)
  Top 0.254: US_HOST.D- v11.15,36.05 | IC3.16 v13.34,40.41
  Bottom 0.254: v11.15,36.05 13.34,36.05 v13.34,40.41
N$49
  Top 0.254: R6.2 72.86,55.19 74.58,55.19 74.58,48.94 IC5.12
N$50
  Top 0.254: R5.2 75.2,56.81 75.2,51.48 IC5.10
N$51
  Top 0.254: R3.2 77.95,54.02 IC5.8
N$52
  Top 0.254: R10.2 80.49,52.75 IC5.6
N$53
  Top 0.254: R11.2 83.02,55.18 84.89,55.18 84.89,50.21 IC5.4
N$54
  Top 0.254: R12.2 85.57,47.67 IC5.2
TO_RX-1
  Top 0.254: IC1.11 9.21,52.4 9.21,58.43 9.21,59.7 R27.2
TO_RX-2
  Top 0.254: R29.1 21.59,58.43 36.51,58.43 36.51,45.45 49,45.45 49,43.89 52.19,43.89 IC4.8
TO_RX-3
  Top 0.254: IC4.11 48.35,44.66 35.88,44.66 35.88,57.79 19.05,57.79 R28.1
V+
  Top 1.5: SERVOS.2 5V.2
  Bottom 1.5: ALIM.1 38.48,5.34 | U$3.+ 43.04,5.36 38.48,5.34 | 5V.2 MMNET.2 38.48,5.34
V_SERVOS
  Bottom 1.5: 10.17,11.28 485.V_SERVOS | TTL.V_SERVOS 10.17,11.28 | 10.17,11.28 17.85,11.28 | 17.85,11.28 17.85,14.51 23,14.51 23,46.94 ALIM_6V_1.2 40.52,46.94 40.52,49.45 ALIM_6V_2.1 | 17.85,11.28 SERVOS.1
V_SERVOS_6V1
  Top 1.5: REG_3.IN 38.22,49.48 ALIM_6V_1.1
V_SERVOS_6V2
  Bottom 1.5: ALIM_6V_2.2 45.39,46.88 REG_2.IN

### Text on the board
tNames: GND | V_SERVO | 11 | 10 | 9 | 8 | 7 | 6 | 5 | 4 | 3 | 2 | 1 | 0 | 470 | 470 | Yeosu Servo Ctrl Board V1.1 | Rhoban Project | 1k | GND | ARM7 | GND | GND | V+